# Altium schematic sheet Cap 22uF 16V.schdoc
size 127 x 101 mm
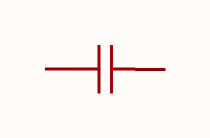
[diagram p0: Cap 22uF 16V.schdoc]

## Parts
C?  22uF  [C0805]  (value not drawn)

## Nets

Not connected (* = marked no-connect by the designer): C? 1 2

## Library data of the parts
C? = GRM21BC81C226ME44L: Manufacturer: muRata(村田); Add into BOM: yes; Tolerance: ±20%; Symbol: GRM21BC81C226ME44L; Device: GRM21BC81C226ME44L; LCSC Part Name: 22uF ±20% 16V; Supplier Part: C258782; Manufacturer Part: GRM21BC81C226ME44L; Supplier Footprint: 0805; JLCPCB Part Class: Extended Part; Datasheet: https://atta.szlcsc.com/upload/public/pdf/source/20200117/C258782_354729B55DBAD136BAA783E298FE5367.pdf; Supplier: LCSC; Convert to PCB: yes; Value: 22uF